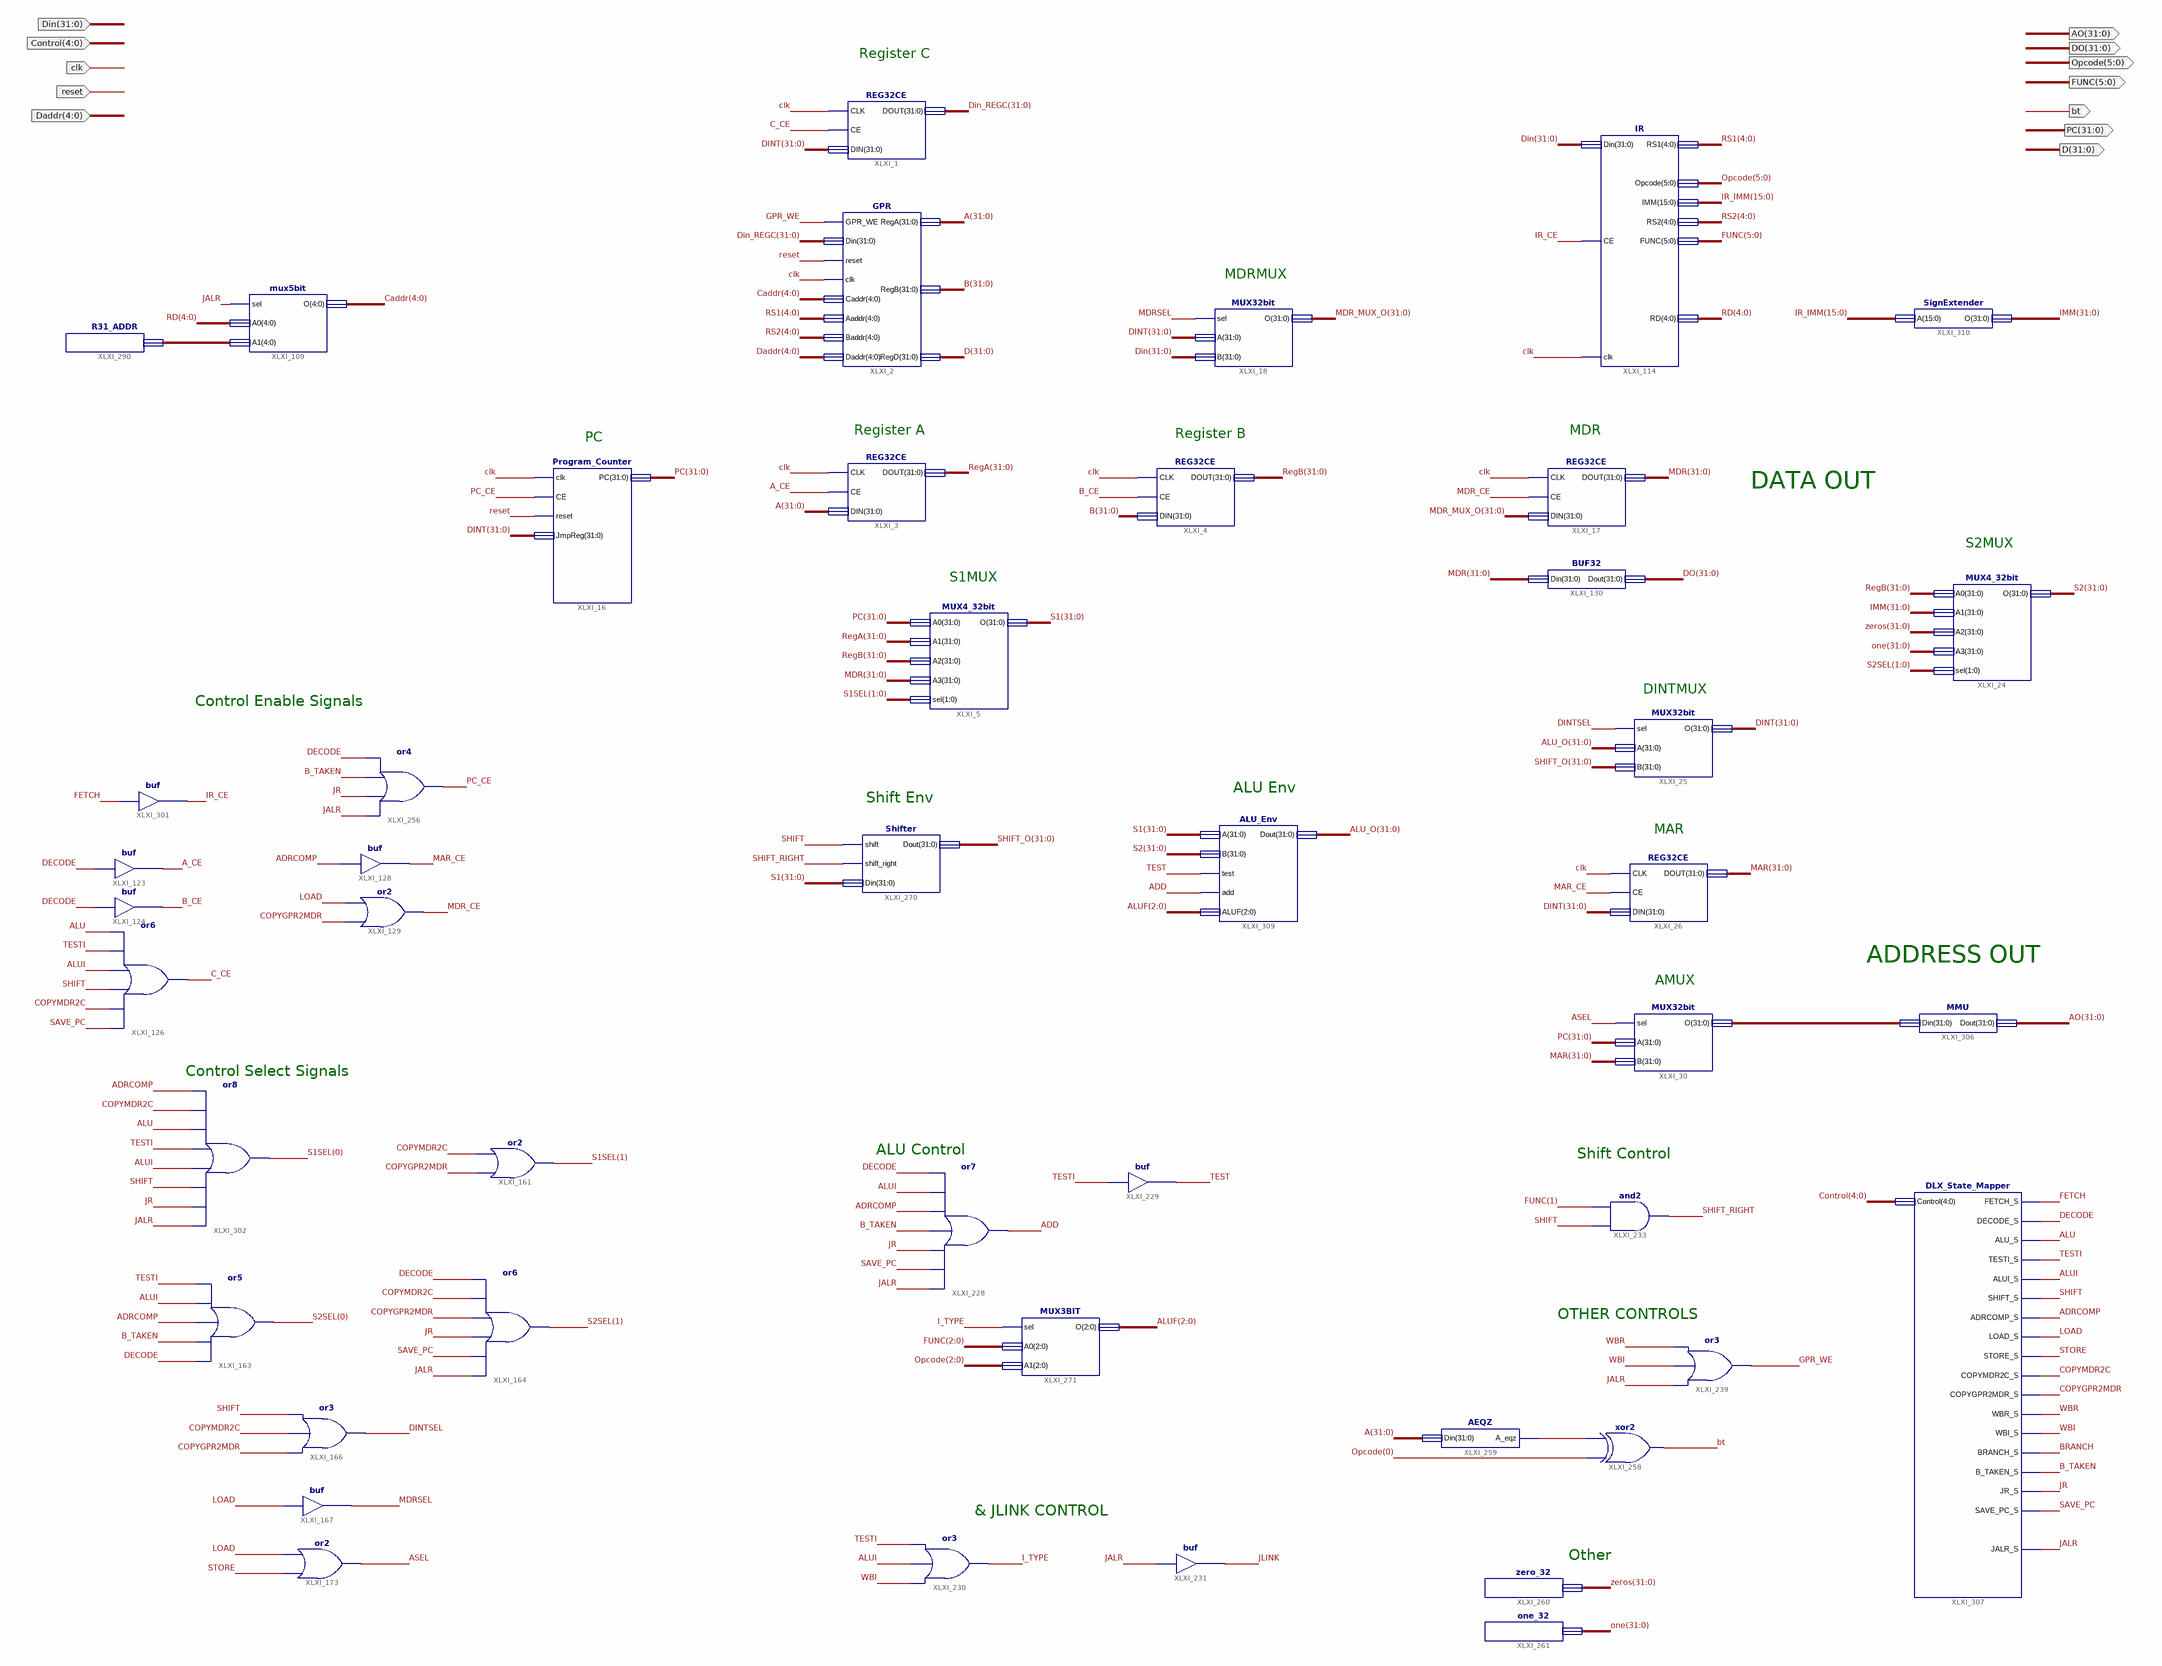
[diagram p0: schematic sheet 1]
// Xilinx ISE schematic Data_Path_DLX.sch (spartan6) as structural Verilog: 46 symbols, 12 ports
module Data_Path_DLX (
  input  clk,
  input  [31:0] Din,
  input  reset,
  input  [4:0] Daddr,
  input  [4:0] Control,
  output [31:0] DO,
  output [31:0] PC,
  output [5:0] Opcode,
  output [31:0] AO,
  output bt,
  output [31:0] D,
  output [5:0] FUNC
);

  wire A_CE, ADD, ADRCOMP, ALU, ALUI, ASEL, B_CE, B_TAKEN, BRANCH, C_CE, COPYGPR2MDR, COPYMDR2C, DECODE,
       DINTSEL, FETCH, GPR_WE, I_TYPE, IR_CE, JALR, JLINK, JR, LOAD, MAR_CE, MDR_CE, MDRSEL, PC_CE, SAVE_PC,
       SHIFT, SHIFT_RIGHT, STORE, TEST, TESTI, WBI, WBR, XLXN_911;
  wire [1:0] S1SEL, S2SEL;
  wire [2:0] ALUF;
  wire [4:0] Caddr, RD, RS1, RS2, XLXN_916;
  wire [15:0] IR_IMM;
  wire [31:0] A, ALU_O, B, Din_REGC, DINT, IMM, MAR, MDR, MDR_MUX_O, one, RegA, RegB, S1, S2, SHIFT_O,
       XLXN_917, zeros;

  buf XLXI_123 (A_CE, DECODE);
  buf XLXI_124 (B_CE, DECODE);
  or XLXI_126 (C_CE, SAVE_PC, COPYMDR2C, SHIFT, ALUI, TESTI, ALU);
  buf XLXI_128 (MAR_CE, ADRCOMP);
  or XLXI_129 (MDR_CE, COPYGPR2MDR, LOAD);
  or XLXI_163 (S2SEL[0], DECODE, B_TAKEN, ADRCOMP, ALUI, TESTI);
  buf XLXI_167 (MDRSEL, LOAD);
  or XLXI_161 (S1SEL[1], COPYGPR2MDR, COPYMDR2C);
  or XLXI_164 (S2SEL[1], JALR, SAVE_PC, JR, COPYGPR2MDR, COPYMDR2C, DECODE);
  or XLXI_166 (DINTSEL, COPYGPR2MDR, COPYMDR2C, SHIFT);
  or XLXI_173 (ASEL, STORE, LOAD);
  GPR XLXI_2 (
    .GPR_WE(GPR_WE), .Din(Din_REGC), .reset(reset), .clk(clk), .Caddr(Caddr), .Aaddr(RS1), .Baddr(RS2),
    .Daddr(Daddr), .RegA(A), .RegB(B), .RegD(D));
  REG32CE XLXI_1 (.CLK(clk), .CE(C_CE), .DIN(DINT), .DOUT(Din_REGC));
  MUX32bit XLXI_18 (.sel(MDRSEL), .A(DINT), .B(Din), .O(MDR_MUX_O));
  MUX4_32bit XLXI_5 (.A0(PC), .A1(RegA), .A2(RegB), .A3(MDR), .sel(S1SEL), .O(S1));
  IR XLXI_114 (
    .Din(Din), .CE(IR_CE), .clk(clk), .RS1(RS1), .Opcode(Opcode), .IMM(IR_IMM), .RS2(RS2), .FUNC(FUNC),
    .RD(RD));
  Program_Counter XLXI_16 (.clk(clk), .CE(PC_CE), .reset(reset), .JmpReg(DINT), .PC(PC));
  REG32CE XLXI_3 (.CLK(clk), .CE(A_CE), .DIN(A), .DOUT(RegA));
  or XLXI_228 (ADD, JALR, SAVE_PC, JR, B_TAKEN, ADRCOMP, ALUI, DECODE);
  buf XLXI_229 (TEST, TESTI);
  or XLXI_230 (I_TYPE, WBI, ALUI, TESTI);
  buf XLXI_231 (JLINK, JALR);
  and XLXI_233 (SHIFT_RIGHT, SHIFT, FUNC[1]);
  mux5bit XLXI_109 (.sel(JALR), .A0(RD), .A1(XLXN_916), .O(Caddr));
  BUF32 XLXI_130 (.Din(MDR), .Dout(DO));
  REG32CE XLXI_4 (.CLK(clk), .CE(B_CE), .DIN(B), .DOUT(RegB));
  REG32CE XLXI_17 (.CLK(clk), .CE(MDR_CE), .DIN(MDR_MUX_O), .DOUT(MDR));
  or XLXI_256 (PC_CE, JALR, JR, B_TAKEN, DECODE);
  zero_32 XLXI_260 (.O(zeros));
  one_32 XLXI_261 (.O(one));
  Shifter XLXI_270 (.shift(SHIFT), .shift_right(SHIFT_RIGHT), .Din(S1), .Dout(SHIFT_O));
  MUX3BIT XLXI_271 (.sel(I_TYPE), .A0(FUNC[2:0]), .A1(Opcode[2:0]), .O(ALUF));
  MUX4_32bit XLXI_24 (.A0(RegB), .A1(IMM), .A2(zeros), .A3(one), .sel(S2SEL), .O(S2));
  MUX32bit XLXI_25 (.sel(DINTSEL), .A(ALU_O), .B(SHIFT_O), .O(DINT));
  REG32CE XLXI_26 (.CLK(clk), .CE(MAR_CE), .DIN(DINT), .DOUT(MAR));
  MUX32bit XLXI_30 (.sel(ASEL), .A(PC), .B(MAR), .O(XLXN_917));
  R31_ADDR XLXI_290 (.O(XLXN_916));
  or XLXI_239 (GPR_WE, JALR, WBI, WBR);
  buf XLXI_301 (IR_CE, FETCH);
  or XLXI_302 (S1SEL[0], JALR, JR, SHIFT, ALUI, TESTI, ALU, COPYMDR2C, ADRCOMP);
  xor XLXI_258 (bt, Opcode[0], XLXN_911);
  AEQZ XLXI_259 (.Din(A), .A_eqz(XLXN_911));
  MMU XLXI_306 (.Din(XLXN_917), .Dout(AO));
  DLX_State_Mapper XLXI_307 (
    .Control(Control), .FETCH_S(FETCH), .DECODE_S(DECODE), .ALU_S(ALU), .TESTI_S(TESTI), .ALUI_S(ALUI),
    .SHIFT_S(SHIFT), .ADRCOMP_S(ADRCOMP), .LOAD_S(LOAD), .STORE_S(STORE), .COPYMDR2C_S(COPYMDR2C),
    .COPYGPR2MDR_S(COPYGPR2MDR), .WBR_S(WBR), .WBI_S(WBI), .BRANCH_S(BRANCH), .B_TAKEN_S(B_TAKEN), .JR_S(JR),
    .SAVE_PC_S(SAVE_PC), .JALR_S(JALR));
  ALU_Env XLXI_309 (.A(S1), .B(S2), .test(TEST), .add(ADD), .ALUF(ALUF), .Dout(ALU_O));
  SignExtender XLXI_310 (.A(IR_IMM), .O(IMM));

  // Notes on the sheet:
  //   Register C
  //   MDRMUX
  //   Register A
  //   MDR
  //   Register B
  //   PC
  //   DATA OUT
  //   S2MUX
  //   S1MUX
  //   DINTMUX
  //   Control Enable Signals
  //   ALU Env
  //   Shift Env
  //   MAR
  //   ADDRESS OUT
  //   AMUX
  //   Control Select Signals
  //   ALU Control
  //   Shift Control
  //   OTHER CONTROLS
  //   & JLINK CONTROL
  //   Other
endmodule
